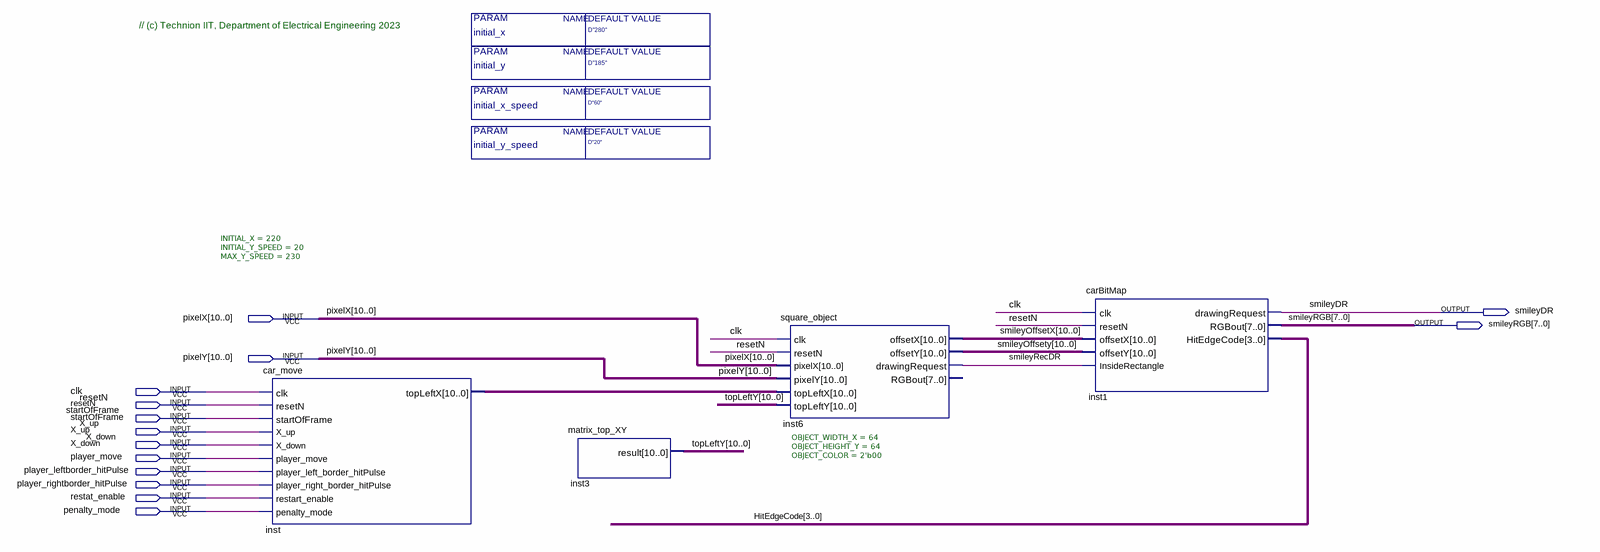
[diagram p0: schematic sheet]
// Quartus schematic player_car_block.bdf as structural Verilog: 4 symbols, 14 pins
module player_car_block #(parameter initial_x = "D\"280\"", parameter initial_y = "D\"185\"", parameter initial_x_speed = "D\"60\"", parameter initial_y_speed = "D\"20\"") (
  input  [10:0] pixelX,
  input  [10:0] pixelY,
  input  clk,
  input  resetN,
  input  startOfFrame,
  input  X_up,
  input  X_down,
  input  player_move,
  input  player_leftborder_hitPulse,
  input  player_rightborder_hitPulse,
  input  restat_enable,
  input  penalty_mode,
  output smileyDR,
  output [7:0] smileyRGB
);

  wire smileyRecDR;
  wire [3:0] HitEdgeCode;
  wire [10:0] inst_topleftx, smileyOffsetX, smileyOffsety, topLeftY;

  car_move #(.INITIAL_X(220), .INITIAL_Y_SPEED(20), .MAX_Y_SPEED(230)) inst (
    .clk(clk), .resetN(resetN), .startOfFrame(startOfFrame), .X_up(X_up), .X_down(X_down),
    .player_move(player_move), .player_left_border_hitPulse(player_leftborder_hitPulse),
    .player_right_border_hitPulse(player_rightborder_hitPulse), .restart_enable(restat_enable),
    .penalty_mode(penalty_mode), .topLeftX(inst_topleftx));
  matrix_top_XY inst3 (.result(topLeftY));
  square_object #(.OBJECT_WIDTH_X(64), .OBJECT_HEIGHT_Y(64), .OBJECT_COLOR(2'b00)) inst6 (
    .clk(clk), .resetN(resetN), .pixelX(pixelX), .pixelY(pixelY), .topLeftX(inst_topleftx),
    .topLeftY(topLeftY), .offsetX(smileyOffsetX), .offsetY(smileyOffsety), .drawingRequest(smileyRecDR));  // open: RGBout
  carBitMap inst1 (
    .clk(clk), .resetN(resetN), .offsetX(smileyOffsetX), .offsetY(smileyOffsety),
    .InsideRectangle(smileyRecDR), .drawingRequest(smileyDR), .RGBout(smileyRGB), .HitEdgeCode(HitEdgeCode));

  // Notes on the sheet:
  //   // (c) Technion IIT, Department of Electrical Engineering 2023
endmodule
